# Altium schematic sheet TLE5012B.SchDoc
size A4
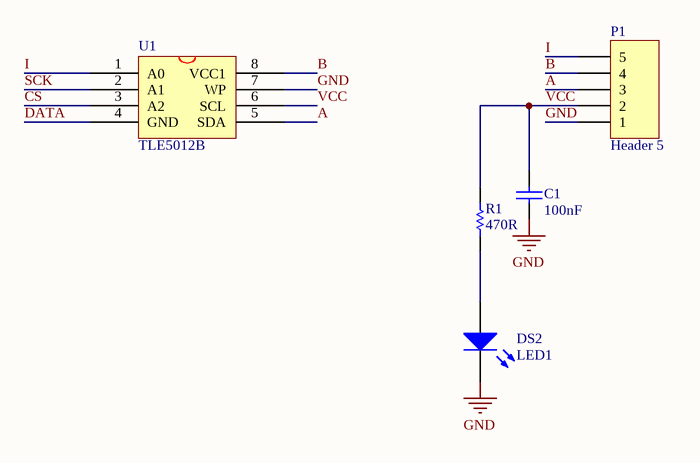
[diagram p0: TLE5012B.SchDoc]

## Parts
C1  100nF  [C 0402]
DS2  LED1  [SMDLED]
P1  Header 5  [PH1.25_5]
R1  470R  [R 0402]
U1  TLE5012B  [SOP-8]

## Nets
GND: C1.2 DS2.2(K) P1.1 U1.7(WP)
A: P1.3 U1.5(SDA)
B : P1.4 U1.8(VCC1)
CS: U1.3(A2)
DATA: U1.4(GND)
I: P1.5 U1.1(A0)
SCK: U1.2(A1)
VCC: C1.1 P1.2 R1.1 U1.6(SCL)
NetDS2_1: DS2.1(A) R1.2

## Library data of the parts
C1 = CAP: Capacitor; Published: 8-Jun-2000; Revision: July-2002: Re-released for DXP Platform.; Publisher: Altium Limited; Value: 100nF
DS2 = LED2: Typical RED, GREEN, YELLOW, AMBER GaAs LED; Published: 8-Jun-2000; LatestRevisionDate: 17-Jul-2002; LatestRevisionNote: Re-released for DXP Platform.; PackageDocument: Feb-2002; PackageReference: 3.2X1.6X1.1; Publisher: Altium Limited
P1 = Header 5: Header, 5-Pin; LatestRevisionDate: 17-Jul-2002; LatestRevisionNote: Re-released for DXP Platform.; Publisher: Altium Limited
R1 = Res2: 0603
U1 = 24C256